# EAGLE design sfp-breakout (EAGLE 7.7.0)
VERSION: v1
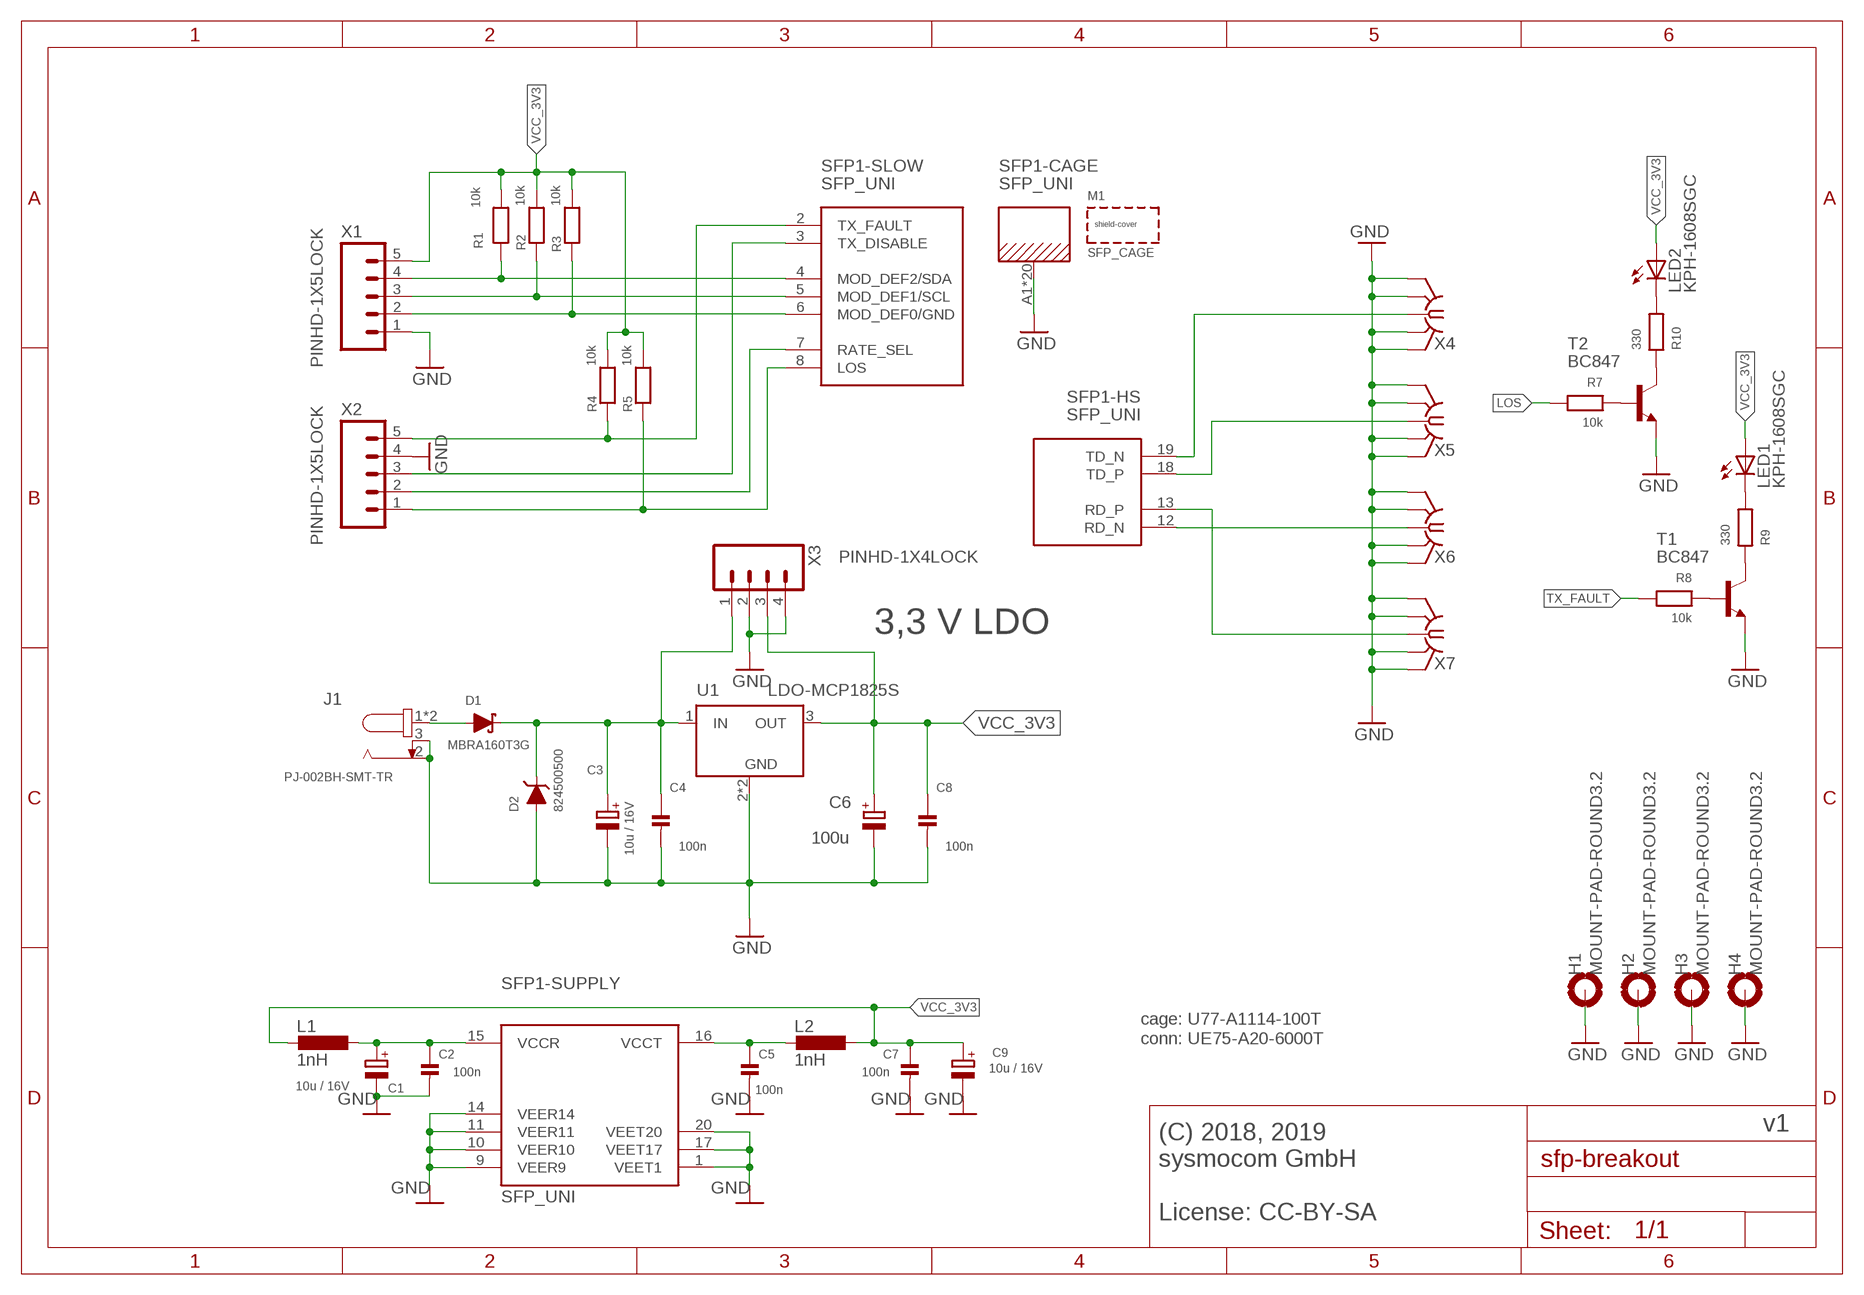
[diagram p0: schematic, sheet 1]
M1 (SHIELD-COVER): CLASS: SHIELD COVER; DESCRIPTION: CONN SFP CAGE SLD R/A; LINK: https://www.digikey.de/product-detail/de/amphenol-icc-commercial-products/U77-A1114-100T/U77-A1114-100TCT-ND; MANUFACTURER: Amphenol ICC (Commercial Products); MANUFACTURERPARTNUMBER: U77-A1114-100T; POPULATED: TRUE; ROHSCERTIFICATE: Bleifrei / RoHS-konform; SCHEM_BOM_ITEM: TRUE; SOURCE: DIGIKEY; SOURCEPARTNUMBER: U77-A1114-100TCT-ND

## Parts
C1  10u / 16V  CPOL-EU-1206  [CPOL1206]
C2  100n  CAP_CERAMIC_0603  [_0603]
C3  10u / 16V  CPOL-EU-1206  [CPOL1206]
C4  100n  CAP_CERAMIC_0603  [_0603]
C5  100n  CAP_CERAMIC_0603  [_0603]
C6  100u  CPOL-EUCT6032  [CT6032]
C7  100n  CAP_CERAMIC_0603  [_0603]
C8  100n  CAP_CERAMIC_0603  [_0603]
C9  10u / 16V  CPOL-EU-1206  [CPOL1206]
D1  MBRA160T3G  DIODE-SCHOTTKY-SMA  [SMADIODE]
D2  824500500  DIODE-TVS-SMA  [SMADIODE]
H1  MOUNT-PAD-ROUND3.2  [3,2-PAD]
H2  MOUNT-PAD-ROUND3.2  [3,2-PAD]
H3  MOUNT-PAD-ROUND3.2  [3,2-PAD]
H4  MOUNT-PAD-ROUND3.2  [3,2-PAD]
J1  PJ-002BH-SMT-TR  694108106102  [694108106102]
L1  1nH  L-EU_0603  [0603]
L2  1nH  L-EU_0603  [0603]
LED1  KPH-1608SGC  LEDCHIP-LED0603  [CHIP-LED0603]
LED2  KPH-1608SGC  LEDCHIP-LED0603  [CHIP-LED0603]
R1  10k  RESISTOR_0603  [_0603]
R2  10k  RESISTOR_0603  [_0603]
R3  10k  RESISTOR_0603  [_0603]
R4  10k  RESISTOR_0603  [_0603]
R5  10k  RESISTOR_0603  [_0603]
R7  10k  RESISTOR_0603  [_0603]
R8  10k  RESISTOR_0603  [_0603]
R9  330  RESISTOR_0603  [_0603]
R10  330  RESISTOR_0603  [_0603]
SFP1  SFP_UNI  [SFP_COMBINED]
T1  BC847  BC847C-NPN-SOT23-BEC  [SOT23-BEC]
T2  BC847  BC847C-NPN-SOT23-BEC  [SOT23-BEC]
U1  LDO-MCP1825S  [SOT223]
X1  PINHD-1X5LOCK  [1X05_LOCK]
X2  PINHD-1X5LOCK  [1X05_LOCK]
X3  PINHD-1X4LOCK  [1X04_LOCK]
X4  SMA-F-S-EDGE  [SMA-F-S-EDGE]
X5  SMA-F-S-EDGE  [SMA-F-S-EDGE]
X6  SMA-F-S-EDGE  [SMA-F-S-EDGE]
X7  SMA-F-S-EDGE  [SMA-F-S-EDGE]

## Nets
+VIN [supply]: C3.+ C4.1 D1.C D2.C U1.1(IN) X3.1
GND [GND-Polys]: C1.- C2.2 C3.- C4.2 C5.2 C6.- C7.2 C8.2 C9.- D2.A H1.B3,2(MOUNT) H2.B3,2(MOUNT) H3.B3,2(MOUNT) H4.B3,2(MOUNT) J1.2 J1.3 SFP1.1(-SUPPLY:VEET1) SFP1.9(-SUPPLY:VEER9) SFP1.10(-SUPPLY:VEER10) SFP1.11(-SUPPLY:VEER11) SFP1.14(-SUPPLY:VEER14) SFP1.17(-SUPPLY:VEET17) SFP1.20(-SUPPLY:VEET20) SFP1.A1(-CAGE:CAGE) SFP1.A2(-CAGE:CAGE) SFP1.A3(-CAGE:CAGE) SFP1.A4(-CAGE:CAGE) SFP1.A5(-CAGE:CAGE) SFP1.A6(-CAGE:CAGE) SFP1.A7(-CAGE:CAGE) SFP1.A8(-CAGE:CAGE) SFP1.A10(-CAGE:CAGE) SFP1.A11(-CAGE:CAGE) SFP1.A12(-CAGE:CAGE) SFP1.B1(-CAGE:CAGE) SFP1.B2(-CAGE:CAGE) SFP1.B3(-CAGE:CAGE) SFP1.B4(-CAGE:CAGE) SFP1.B5(-CAGE:CAGE) SFP1.B6(-CAGE:CAGE) SFP1.B7(-CAGE:CAGE) SFP1.B8(-CAGE:CAGE) SFP1.B10(-CAGE:CAGE) T1.E T2.E U1.2(GND) U1.4(GND) X1.1 X2.4 X3.2 X3.4 X4.BG1(GND) X4.BG2(GND) X4.TG1(GND) X4.TG2(GND) X5.BG1(GND) X5.BG2(GND) X5.TG1(GND) X5.TG2(GND) X6.BG1(GND) X6.BG2(GND) X6.TG1(GND) X6.TG2(GND) X7.BG1(GND) X7.BG2(GND) X7.TG1(GND) X7.TG2(GND)
LOS: R5.1 R7.2 SFP1.8(-SLOW:LOS) X2.1
MOD_DEF0/GND: R3.1 SFP1.6(-SLOW:MOD_DEF0/GND) X1.2
MOD_DEF1/SCL: R2.1 SFP1.5(-SLOW:MOD_DEF1/SCL) X1.3
MOD_DEF2/SDA: R1.1 SFP1.4(-SLOW:MOD_DEF2/SDA) X1.4
N$1 [supply]: D1.A J1.1 J1.1-1
N$3: R7.1 T2.B
N$4: LED2.C R10.2
N$5 [supply]: C5.1 L2.2 SFP1.16(-SUPPLY:VCCT)
N$6 [supply]: C1.+ C2.1 L1.1 SFP1.15(-SUPPLY:VCCR)
N$7: R10.1 T2.C
N$138: R8.1 T1.B
N$139: LED1.C R9.2
N$141: R9.1 T1.C
RATE_SEL: SFP1.7(-SLOW:RATE_SEL) X2.2
RD_N [lvds]: SFP1.12(-HS:RD_N) X6.C
RD_P [lvds]: SFP1.13(-HS:RD_P) X7.C
TD_N [lvds]: SFP1.19(-HS:TD_N) X4.C
TD_P [lvds]: SFP1.18(-HS:TD_P) X5.C
TX_DISABLE: SFP1.3(-SLOW:TX_DISABLE) X2.3
TX_FAULT: R4.1 R8.2 SFP1.2(-SLOW:TX_FAULT) X2.5
VCC_3V3 [supply]: C6.+ C7.1 C8.1 C9.+ L1.2 L2.1 LED1.A LED2.A R1.2 R2.2 R3.2 R4.2 R5.2 U1.3(OUT) X1.5 X3.3

## Notes on the sheet
- 3,3 V LDO
- cage: U77-A1114-100T
- conn: UE75-A20-6000T
- (C) 2018, 2019 
  sysmocom GmbH
  
  License: CC-BY-SA

## Library data of the parts
C1 C3 C9 = sfp-breakout:CPOL-EU; CLASS: CAPACITOR; DATASHEET: https://www.samsungsem.com/kr/support/product-search/mlcc/CL31A106KOHNNNE.jsp; DESCRIPTION: CAP CER 10UF 16V X5R 1206; LINK: https://www.digikey.com/en/products/detail/samsung-electro-mechanics/CL31A106KOHNNNE/3886795; MANUFACTURER: Samsung Electro-Mechanics; MANUFACTURERPARTNUMBER: CL31A106KOHNNNE; POPULATED: TRUE; ROHSCERTIFICATE: ROHS3 Compliant; SOURCE: DIGIKEY; SOURCEPARTNUMBER: 1276-1137-1-ND
C2 C4 C5 C7 C8 = sfp-breakout:CAP_CERAMIC: Ceramic Capacitors 0402 - 0402 Surface Mount Capacitors 16pF 50V 5% [Digikey: 445-4899-2-ND] 18pF 50V 5% [Digikey: 490-1281-2-ND] 22pF 50V 5% [Digikey: 490-1283-2-ND] 68pF 50V 5% [Digikey: 490-1289-2-ND] 0.1uF 10V 10% [Digikey: 490-1318-2-ND] 1.0uF 6.3V 10% [Digikey: 490-1320-2-ND] 0603 - 0603 Surface Mount Capacitors 16 pF 50V 5% [Digikey: 445-5051-2-ND] 22 pF 50V [Digikey: PCC220ACVTR-ND] 33 pF 50V 5% [Digikey: 490-1415-1-ND] 56pF 50V 5% [Digikey: 490-1421-1-ND] 220pF 50V 5% [Digikey: 445-1285-1-ND] 680 pF 50V 2200 pF 50V 5% C0G [Digikey: 445-1297-1-ND] 5600 pF 100V 5% X7R [Digikey: 478-3711-1-ND] 0.1 µF 25V 10% [Digikey: PCC2277TR-ND] 0.22 µF 16V 10% X7R [Digikey: 445-1318-1-ND] 1.0 µF 25V 10% [Digikey: 445-5146-2-ND] 0603 - RF Specific 3pF 250V +/-0.1pF RF [Digikey: 712-1347-1-ND] 18 pF 250V 5% [Digikey: 478-3505-1-ND or 712-1322-1-ND] 56 pF 250V 5% C0G RF [Digikey: 490-4867-1-ND] 68 pF 250V RF [Digikey: 490-4868-1-ND] 0805 - 0805 Surface Mount Capacitors 220 pF 250V 2% RF Ceramic Capacitor [Digikey: 712-1398-1-ND] 1000 pF 50V 2% NP0 Ceramic Capacitor [Digikey: 478-3760-1-ND] 0.1 µF 25V 10% Ceramic Capacitor [Digikey: PCC1828TR-ND] 1.0 µF 16V 10% Ceramic Capacitor[Digikey: 490-1691-2-ND] 10.0 µF 10V 10% Ceramic Capacitor[Digikey: 709-1228-1-ND] 10.0 uF 16V 10% Ceramic Capacitor [Digikey: 478-5165-2-ND] 47 uF 6.3V 20% Ceramic Capacitor [Digikey: 587-1779-1-ND or 399-5506-1-ND] 1206 - 1206 Surface Mount Capacitors 47uF 10V 20% Ceramic Capacitor [Digikey: 490-5528-1-ND or 399-5508-1-ND or 445-6010-1-ND] 100uF 6.3V -20%, +80% Y5V Ceramic Capacitor (Digikey: 490-4512-1-ND, Mouser: 81-GRM31CF50J107ZE1L) 1810 - 1810 Surface Mount Capacitors High volt MLC; no solder stop between for higher isolation; CLASS: CAPACITOR; DATASHEET: http://www.samsungsem.com/kr/support/product-search/mlcc/CL10B104KO8NNNC.jsp; DESCRIPTION: CAP CER 0.1UF 16V X7R 0603; LINK: https://www.digikey.com/product-detail/en/samsung-electro-mechanics/CL10B104KO8NNNC/1276-1005-1-ND/3889091; MANUFACTURER: Samsung Electro-Mechanics; MANUFACTURERPARTNUMBER: CL10B104KO8NNNC; POPULATED: TRUE; ROHSCERTIFICATE: ROHS3 Compliant; SOURCE: DIGIKEY; SOURCEPARTNUMBER: 1276-1005-1-ND
C6 = rcl:CPOL-EU: POLARIZED CAPACITOR, European symbol; CLASS: CAPACITOR; DATASHEET: https://datasheets.avx.com/TPS.pdf; DESCRIPTION: CAP TANT 100UF 10% 6.3V 2312; LINK: https://www.digikey.com/product-detail/en/avx-corporation/TPSC107K006R0150/478-1764-1-ND/564796; MANUFACTURER: AVX Corporation; MANUFACTURERPARTNUMBER: TPSC107K006R0150; POPULATED: TRUE; ROHSCERTIFICATE: ROHS3 Compliant; SOURCE: DIGIKEY; SOURCEPARTNUMBER: 478-1764-1-ND
D1 = sfp-breakout:DIODE-SCHOTTKY: Diode SMA Model Volts Amps Type Vf Vr Digikey # Notes SSA34-E3 40V 3A Schottky 480mV @ 3A 200uA @ 40V SSA34-E3/61TGITR-ND CDBA120-G 20V 1A Schottky 500mV @ 1A 500uA @ 20V 641-1014-6-ND REEL MBRA210 10V 2A Schottky 350mV @ 2A 700uA @ 10V MBRA210LT3 SOD-123 Model Volts Amps Type Vf Vr Order # Notes BAT54T1G 30V 200mA Schottky 800mV @ 200mA 2uA @ 25V BAT54T1GOSTR-ND B0530W 30V 500mA Schottky 430mV @ 500mA 130uA @ 30V B0530W-FDICT-ND REEL MBR120 1A 20V Schottky 340mV @ 1A MBR120VLSFT1GOSCT-ND SOD-323 Model Volts Amps Type Vf Vr Order # Notes PMEG2005EJ 20V 500mA Schottky 355mV @ 500mA 568-4110-1-ND ZLLS410 10V 570mA Schottky 380mV @ 570mA ZLLS410CT-ND 1N4148WS 75V 150mA Silicon/Simple 1V 1N4148WSFSCT-ND REEL SOD-523 Model Volts Amps Type Vf Vr Order # Notes BAT54XV2 30V 200mA Schottky 0.8V @ 100mA BAT54XV2CT-ND TB751S 30V 30mA Schottky RB751S-40TE61CT-ND SOT23-R/W (R = Solder Paste/Reflow Ovens, W = Hand-Soldering) Model Volts Amps Type Vf Vr Order # Notes BAT54FILM 40V 300mA Schottky 497-7162-1-ND; CLASS: DIODE; DATASHEET: https://www.diodes.com/assets/Datasheets/B220_A-B260_A.pdf; DESCRIPTION: DIODE SCHOTTKY 60V 2A SMA; LINK: https://www.digikey.com/en/products/detail/diodes-incorporated/B260A-13-F/750837; MANUFACTURER: Diodes Incorporated; MANUFACTURERPARTNUMBER: B260A-13-F; POPULATED: TRUE; ROHSCERTIFICATE: ROHS3 Compliant; SOURCE: DIGIKEY; SOURCEPARTNUMBER: B260A-FDICT-ND
D2 = sfp-breakout:DIODE-TVS; CLASS: DIODE; DATASHEET: https://www.we-online.de/katalog/datasheet/824500500.pdf; DESCRIPTION: TVS DIODE 5V 9.2V DO214AC; LINK: https://www.digikey.com/product-detail/en/w-rth-elektronik/824500500/732-9974-1-ND/5871127; MANUFACTURER: Würth Elektronik; MANUFACTURERPARTNUMBER: 824500500; POPULATED: TRUE; ROHSCERTIFICATE: ROHS3 Compliant; SOURCE: DIGIKEY; SOURCEPARTNUMBER: 732-9974-1-ND
H1-H4 = sfp-breakout:MOUNT-PAD-ROUND: MOUNTING PAD, round; CLASS: HOLE; DESCRIPTION: NO DESCRIPTION; LINK: UNKNOWN LINK; MANUFACTURER: UNKNOWN MANUFACTURER; MANUFACTURERPARTNUMBER: UNKNOWN MANUFACTURER PART NUMBER; POPULATED: FALSE; ROHSCERTIFICATE: UNKNOWN ROHS CERTIFICATE; SOURCE: UNKNOWN SOURCE; SOURCEPARTNUMBER: UNKNOWN SOURCE PART NUMBER
J1 = Wurth_Elektronik_Electromechanic_DC_Power_Jack_Connectors_rev15c:694108106102: WR-DC_DC Power Jack_Right Angled_SMT Center Pin Ø2.5_Plug ID Ø2.55_Plug OD Ø5.5_with 4 Soldering Pad & Peg ;=>Code : Con_WR-DC_SMT_694108106102_694108106102 <http://katalog.we-online.de/media/images/eican/Con_WR-DC_SMT_694108106102_pf2.jpg> Details see: http://katalog.we-online.de/em/datasheet/6941xx106102.pdf Created 2014-10-08, Karrer Zheng 2014 (C) Wurth Elektronik; CLASS: CONNECTOR; DATASHEET: https://www.cuidevices.com/product/resource/pj-002bh-smt-tr.pdf; DESCRIPTION: CONN PWR JACK 2.5X5.5MM SOLDER; LINK: https://www.digikey.com/product-detail/en/cui-devices/PJ-002BH-SMT-TR/CP-002BHPJCT-ND/669694; MANUFACTURER: CUI Devices; MANUFACTURERPARTNUMBER: PJ-002BH-SMT-TR; POPULATED: TRUE; ROHSCERTIFICATE: RoHS Compliant; SOURCE: DIGIKEY; SOURCEPARTNUMBER: CP-002BHPJCT-ND
L1 L2 = sfp-breakout:L-EU: Inductor; CLASS: INDUCTOR; DATASHEET: https://abracon.com/Magnetics/new/AIMC-0603.pdf; DESCRIPTION: FIXED IND 1NH 500MA 50 MOHM SMD; LINK: https://www.digikey.com/product-detail/en/abracon-llc/AIMC-0603-1N0S-T/535-11529-1-ND/2782759; MANUFACTURER: Abracon LLC; MANUFACTURERPARTNUMBER: AIMC-0603-1N0S-T; POPULATED: TRUE; ROHSCERTIFICATE: RoHS Compliant; SOURCE: DIGIKEY; SOURCEPARTNUMBER: 535-11529-1-ND
LED1 LED2 = led:LED: LED OSRAM: - CHIPLED LG R971, LG N971, LY N971, LG Q971, LY Q971, LO R971, LY R971 LH N974, LH R974 LS Q976, LO Q976, LY Q976 LO Q996 - Hyper CHIPLED LW Q18S LB Q993, LB Q99A, LB R99A - SideLED LS A670, LO A670, LY A670, LG A670, LP A670 LB A673, LV A673, LT A673, LW A673 LH A674 LY A675 LS A676, LA A676, LO A676, LY A676, LW A676 LS A679, LY A679, LG A679 - Hyper Micro SIDELED® LS Y876, LA Y876, LO Y876, LY Y876 LT Y87S - SmartLED LW L88C, LW L88S LB L89C, LB L89S, LG L890 LS L89K, LO L89K, LY L89K LS L896, LA L896, LO L896, LY L896 - TOPLED LS T670, LO T670, LY T670, LG T670, LP T670 LSG T670, LSP T670, LSY T670, LOP T670, LYG T670 LG T671, LOG T671, LSG T671 LB T673, LV T673, LT T673, LW T673 LH T674 LS T676, LA T676, LO T676, LY T676, LB T676, LH T676, LSB T676, LW T676 LB T67C, LV T67C, LT T67C, LS T67K, LO T67K, LY T67K, LW E67C LS E67B, LA E67B, LO E67B, LY E67B, LB E67C, LV E67C, LT E67C LW T67C LS T679, LY T679, LG T679 LS T770, LO T770, LY T770, LG T770, LP T770 LB T773, LV T773, LT T773, LW T773 LH T774 LS E675, LA E675, LY E675, LS T675 LS T776, LA T776, LO T776, LY T776, LB T776 LHGB T686 LT T68C, LB T68C - Hyper Mini TOPLED® LB M676 - Mini TOPLED Santana® LG M470 LS M47K, LO M47K, LY M47K Source: http://www.osram.convergy.de LUXEON: - LUMILED® LXK2-PW12-R00, LXK2-PW12-S00, LXK2-PW14-U00, LXK2-PW14-V00 LXK2-PM12-R00, LXK2-PM12-S00, LXK2-PM14-U00 LXK2-PE12-Q00, LXK2-PE12-R00, LXK2-PE12-S00, LXK2-PE14-T00, LXK2-PE14-U00 LXK2-PB12-K00, LXK2-PB12-L00, LXK2-PB12-M00, LXK2-PB14-N00, LXK2-PB14-P00, LXK2-PB14-Q00 LXK2-PR12-L00, LXK2-PR12-M00, LXK2-PR14-Q00, LXK2-PR14-R00 LXK2-PD12-Q00, LXK2-PD12-R00, LXK2-PD12-S00 LXK2-PH12-R00, LXK2-PH12-S00 LXK2-PL12-P00, LXK2-PL12-Q00, LXK2-PL12-R00 Source: www.luxeon.com KINGBRIGHT: KA-3528ASYC Source: www.kingbright.com; CLASS: LED; DESCRIPTION: NO DESCRIPTION; LINK: UNKNOWN LINK; MANUFACTURER: UNKNOWN MANUFACTURER; MANUFACTURERPARTNUMBER: UNKNOWN MANUFACTURER PART NUMBER; POPULATED: TRUE; ROHSCERTIFICATE: UNKNOWN ROHS CERTIFICATE; SOURCE: UNKNOWN SOURCE; SOURCEPARTNUMBER: UNKNOWN SOURCE PART NUMBER
R1-R5 = sfp-breakout:RESISTOR: Resistors 0402 - 0402 Surface Mount Package 22 Ohm 1% 1/16W [Digikey: 311-22.0LRTR-ND] 33 Ohm 5% 1/16W 1.0K 5% 1/16W 1.5K 5% 1/16W 2.0K 1% 1/16W 10.0K 1% 1/16W [Digikey: 311-10.0KLRTR-ND] 10.0K 5% 1/16W [Digikey: RMCF0402JT10K0TR-ND] 12.1K 1% 1/16W [Digikey: 311-22.0LRTR-ND] 100.0K 5% 1/16W 0603 - 0603 Surface Mount Package 1/10 Watt 0805 - 0805 Surface Mount Package 1/8 Watt 1206 - 1206 Surface Mount Package 2012 - 2010 Surface Mount Package 0.11 Ohm 1/2 Watt 1% Resistor - Digikey: RHM.11UCT-ND; CLASS: RESISTOR; DATASHEET: https://www.seielect.com/catalog/sei-rmcf_rmcp.pdf; DESCRIPTION: RES 10K OHM 1% 1/10W 0603; LINK: https://www.digikey.com/product-detail/en/stackpole-electronics-inc/RMCF0603FT10K0/RMCF0603FT10K0CT-ND/1943057; MANUFACTURER: Stackpole Electronics Inc; MANUFACTURERPARTNUMBER: RMCF0603FT10K0; POPULATED: TRUE; ROHSCERTIFICATE: ROHS3 Compliant; SOURCE: DIGIKEY; SOURCEPARTNUMBER: RMCF0603FT10K0CT-ND
R7 R8 = rc-sysmocom:RESISTOR: Resistors 0402 - 0402 Surface Mount Package 22 Ohm 1% 1/16W [Digikey: 311-22.0LRTR-ND] 33 Ohm 5% 1/16W 1.0K 5% 1/16W 1.5K 5% 1/16W 2.0K 1% 1/16W 10.0K 1% 1/16W [Digikey: 311-10.0KLRTR-ND] 10.0K 5% 1/16W [Digikey: RMCF0402JT10K0TR-ND] 12.1K 1% 1/16W [Digikey: 311-22.0LRTR-ND] 100.0K 5% 1/16W 0603 - 0603 Surface Mount Package 1/10 Watt 0805 - 0805 Surface Mount Package 1/8 Watt 1206 - 1206 Surface Mount Package 2012 - 2010 Surface Mount Package 0.11 Ohm 1/2 Watt 1% Resistor - Digikey: RHM.11UCT-ND; CLASS: RESISTOR; DATASHEET: https://www.seielect.com/catalog/sei-rmcf_rmcp.pdf; DESCRIPTION: RES 10K OHM 1% 1/10W 0603; LINK: https://www.digikey.com/product-detail/en/stackpole-electronics-inc/RMCF0603FT10K0/RMCF0603FT10K0CT-ND/1943057; MANUFACTURER: Stackpole Electronics Inc; MANUFACTURERPARTNUMBER: RMCF0603FT10K0; POPULATED: TRUE; ROHSCERTIFICATE: ROHS3 Compliant; SOURCE: DIGIKEY; SOURCEPARTNUMBER: RMCF0603FT10K0CT-ND
R9 R10 = rc-sysmocom:RESISTOR: Resistors 0402 - 0402 Surface Mount Package 22 Ohm 1% 1/16W [Digikey: 311-22.0LRTR-ND] 33 Ohm 5% 1/16W 1.0K 5% 1/16W 1.5K 5% 1/16W 2.0K 1% 1/16W 10.0K 1% 1/16W [Digikey: 311-10.0KLRTR-ND] 10.0K 5% 1/16W [Digikey: RMCF0402JT10K0TR-ND] 12.1K 1% 1/16W [Digikey: 311-22.0LRTR-ND] 100.0K 5% 1/16W 0603 - 0603 Surface Mount Package 1/10 Watt 0805 - 0805 Surface Mount Package 1/8 Watt 1206 - 1206 Surface Mount Package 2012 - 2010 Surface Mount Package 0.11 Ohm 1/2 Watt 1% Resistor - Digikey: RHM.11UCT-ND; CLASS: RESISTOR; DATASHEET: https://www.yageo.com/upload/media/product/productsearch/datasheet/rchip/PYu-RC_Group_51_RoHS_L_11.pdf; DESCRIPTION: RES SMD 330 OHM 1% 1/10W 0603; LINK: https://www.digikey.com/product-detail/en/yageo/RC0603FR-07330RL/311-330HRCT-ND/730109; MANUFACTURER: Yageo; MANUFACTURERPARTNUMBER: RC0603FR-07330RL; POPULATED: TRUE; ROHSCERTIFICATE: ROHS3 Compliant; SOURCE: DIGIKEY; SOURCEPARTNUMBER: 311-330HRCT-ND
SFP1 = sfp-breakout:SFP_UNI; CLASS: CONNECTOR; DATASHEET: https://media.digikey.com/pdf/Data%20Sheets/Amphenol%20PDFs/Ux75-A20-x00xx.pdf; DESCRIPTION: CONN SFP RCPT 20POS SLD R/A SMD; LINK: https://www.digikey.com/product-detail/en/amphenol-icc-commercial-products/UE75-A20-6000T/UE75-A20-6000TCT-ND/1242798; MANUFACTURER: Amphenol ICC (Commercial Products); MANUFACTURERPARTNUMBER: UE75-A20-6000T; POPULATED: TRUE; ROHSCERTIFICATE: RoHS Compliant; SOURCE: DIGIKEY; SOURCEPARTNUMBER: UE75-A20-6000TCT-ND
T1 T2 = transistor:*-NPN-: NPN Transistror BF959 corrected 2008.03.06; CLASS: TRANSISTOR; DATASHEET: https://assets.nexperia.com/documents/data-sheet/BC847_SER.pdf; DESCRIPTION: TRANS NPN 45V 0.1A SOT23; LINK: https://www.digikey.com/product-detail/en/nexperia-usa-inc/BC847C,215/1727-2924-1-ND/763463; MANUFACTURER: Nexperia USA Inc.; MANUFACTURERPARTNUMBER: BC847C,215; POPULATED: TRUE; ROHSCERTIFICATE: ROHS3 Compliant; SOURCE: DIGIKEY; SOURCEPARTNUMBER: 1727-2924-1-ND
U1 = sfp-breakout:LDO; CLASS: IC; DATASHEET: https://ww1.microchip.com/downloads/en/DeviceDoc/22056b.pdf; DESCRIPTION: IC REG LIN 3.3V 500MA SOT223-3; LINK: https://www.digikey.com/en/products/detail/microchip-technology/MCP1825ST-3302E-DB/1635518; MANUFACTURER: Microchip Technology; MANUFACTURERPARTNUMBER: MCP1825ST-3302E/DB; POPULATED: TRUE; ROHSCERTIFICATE: ROHS3 Compliant; SOURCE: DIGIKEY; SOURCEPARTNUMBER: MCP1825ST-3302E/DBCT-ND
X1 X2 = sfp-breakout:PINHD-1X5: Header 5 Standard 5-pin 0.1" header; CLASS: CONNECTOR; DESCRIPTION: NO DESCRIPTION; LINK: UNKNOWN LINK; MANUFACTURER: UNKNOWN MANUFACTURER; MANUFACTURERPARTNUMBER: UNKNOWN MANUFACTURER PART NUMBER; POPULATED: TRUE; ROHSCERTIFICATE: UNKNOWN ROHS CERTIFICATE; SOURCE: UNKNOWN SOURCE; SOURCEPARTNUMBER: UNKNOWN SOURCE PART NUMBER
X3 = sfp-breakout:PINHD-1X4: Header 4 Standard 4-pin 0.1" header; CLASS: CONNECTOR; DESCRIPTION: NO DESCRIPTION; LINK: UNKNOWN LINK; MANUFACTURER: UNKNOWN MANUFACTURER; MANUFACTURERPARTNUMBER: UNKNOWN MANUFACTURER PART NUMBER; POPULATED: TRUE; ROHSCERTIFICATE: UNKNOWN ROHS CERTIFICATE; SOURCE: UNKNOWN SOURCE; SOURCEPARTNUMBER: UNKNOWN SOURCE PART NUMBER
X4-X7 = sfp-breakout:SMA-F; CLASS: CONNECTOR; DESCRIPTION: NO DESCRIPTION; LINK: UNKNOWN LINK; MANUFACTURER: UNKNOWN MANUFACTURER; MANUFACTURERPARTNUMBER: UNKNOWN MANUFACTURER PART NUMBER; POPULATED: TRUE; ROHSCERTIFICATE: UNKNOWN ROHS CERTIFICATE; SOURCE: UNKNOWN SOURCE; SOURCEPARTNUMBER: UNKNOWN SOURCE PART NUMBER

## Net classes
1 lvds: width 0.33 mm, clearance 0.25 mm
2 GND-Polys: width 1 mm, clearance 0.6 mm to class 1
3 supply: width 0.6 mm, clearance 0.038 mm to class 1, clearance 0.5 mm to class 2

## Board
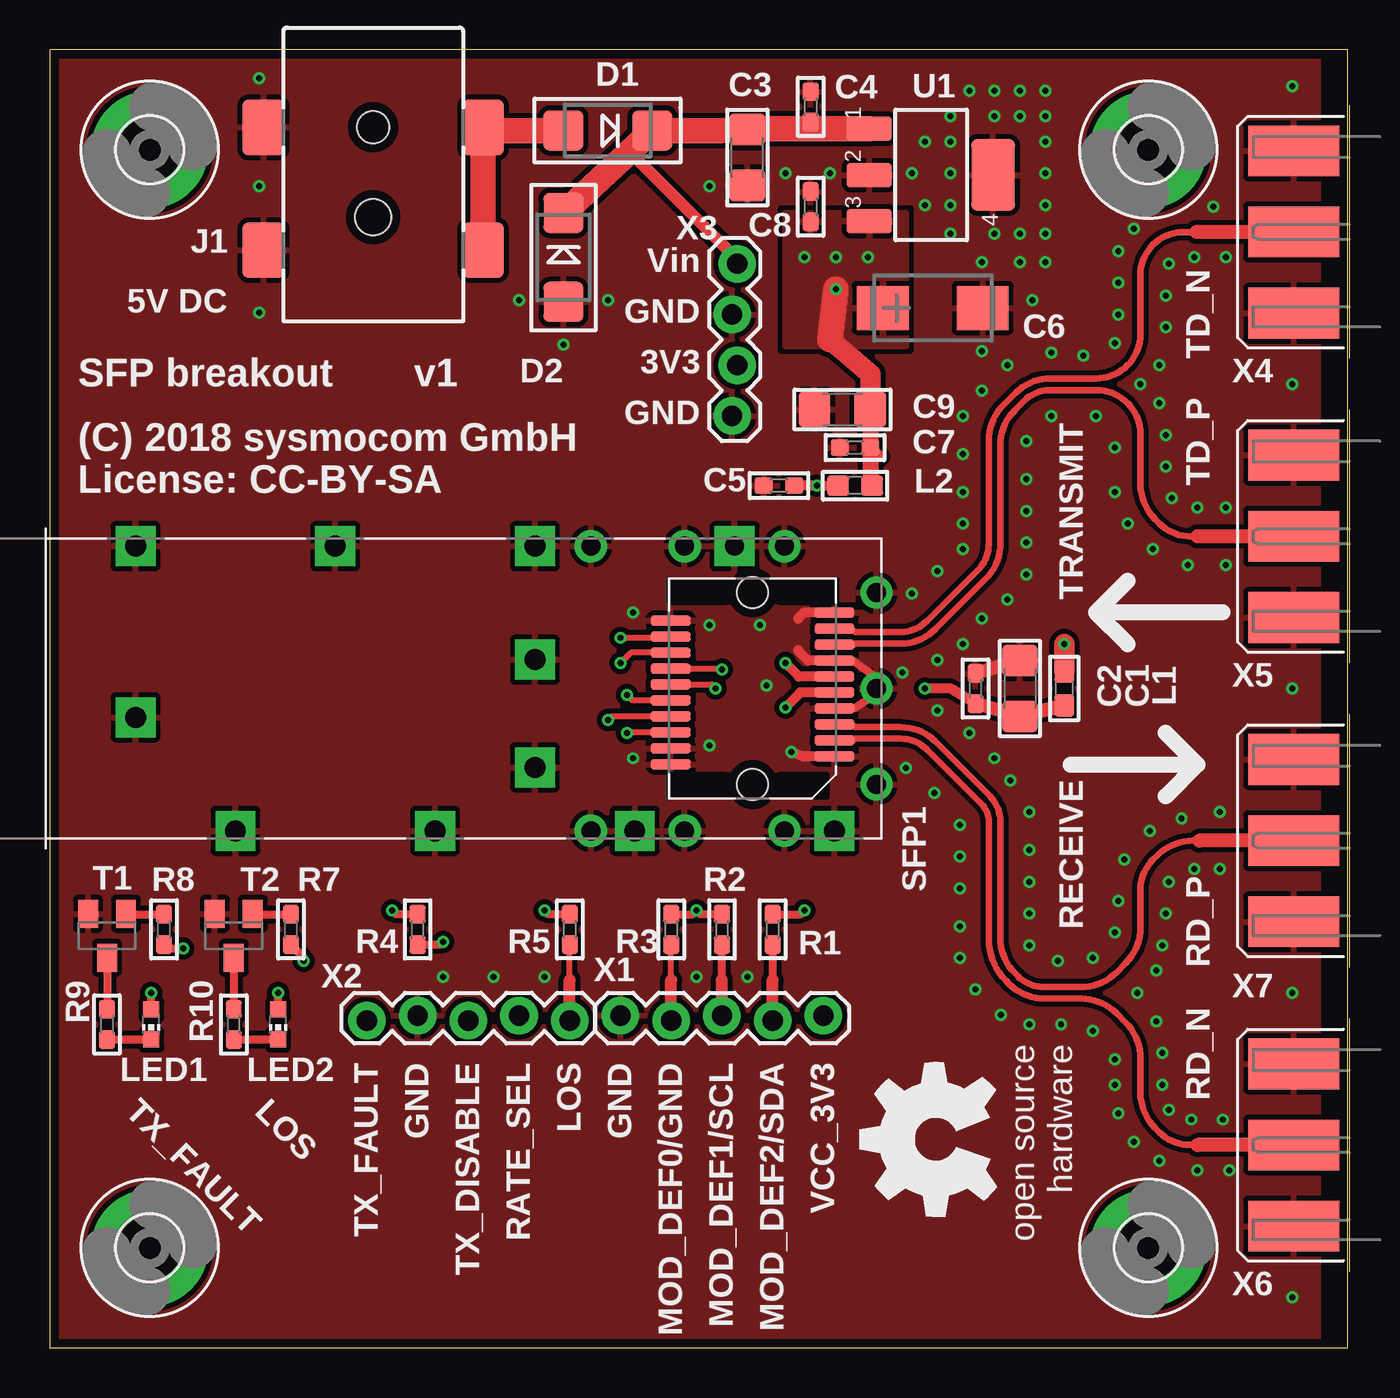
[diagram p1: board, top side]
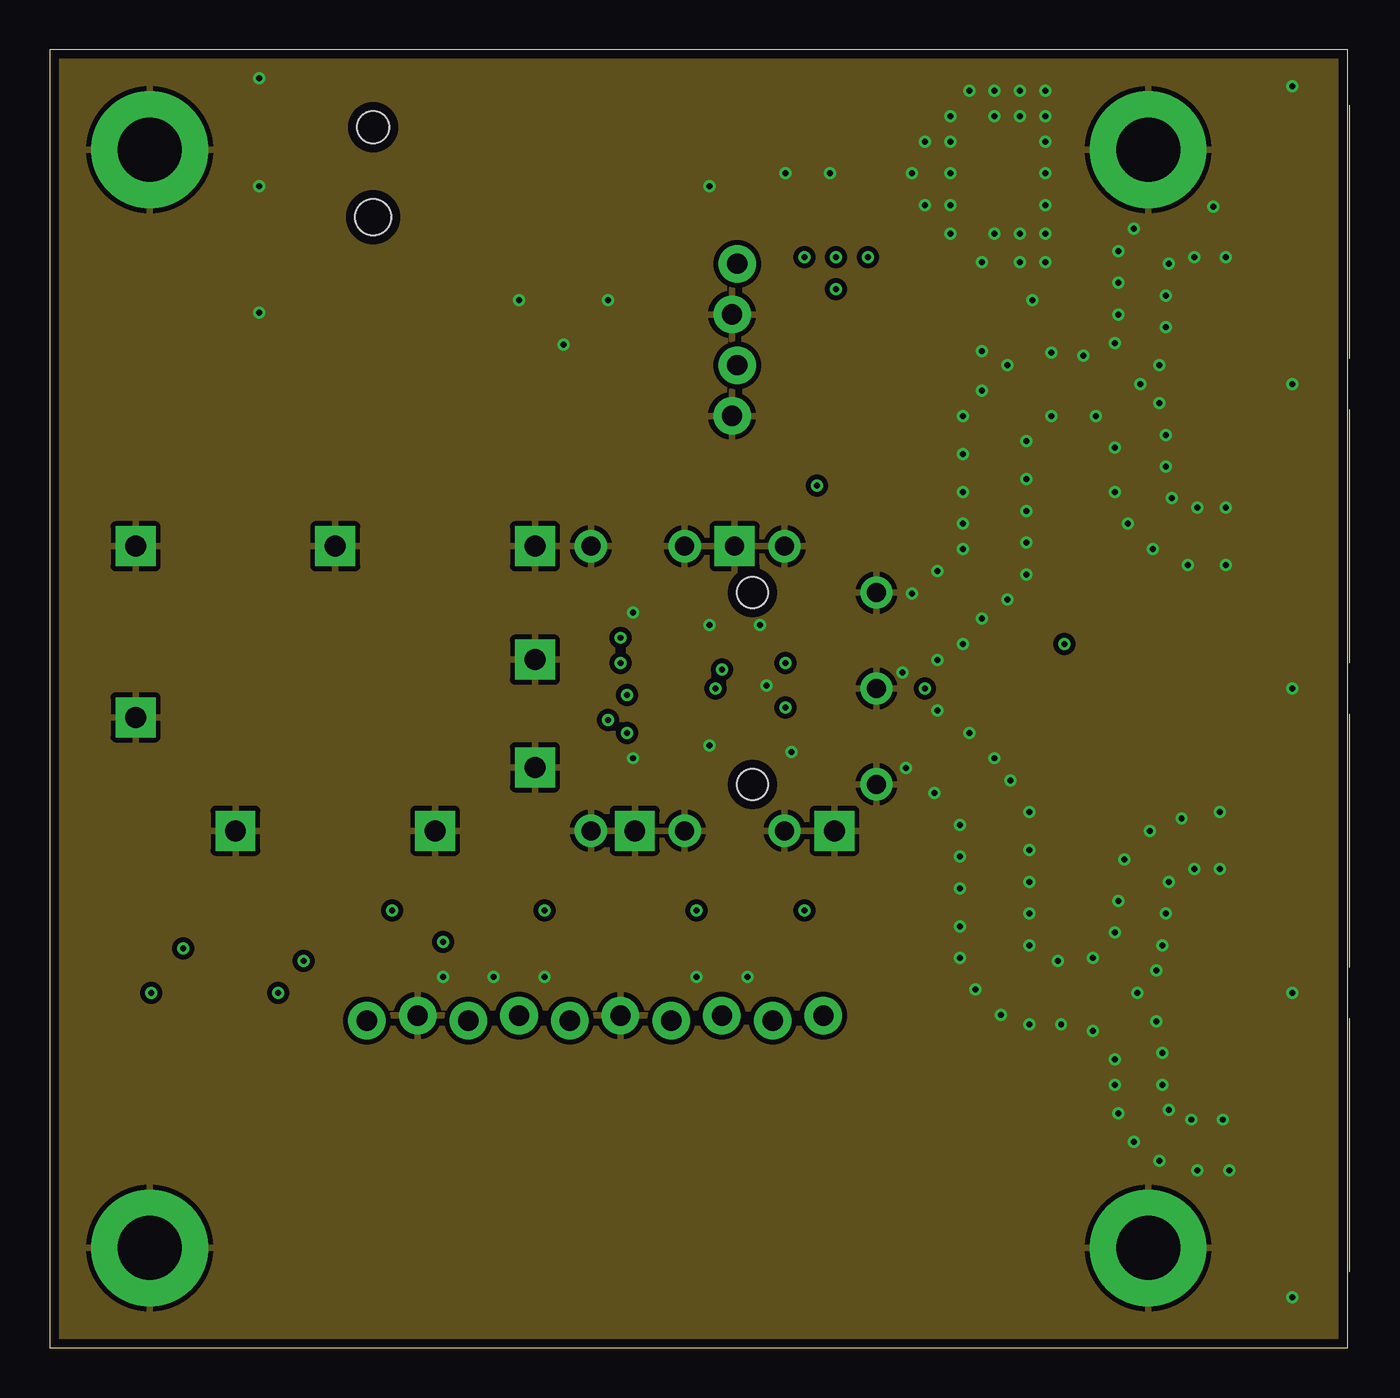
[diagram p2: board, inner layer Route2]
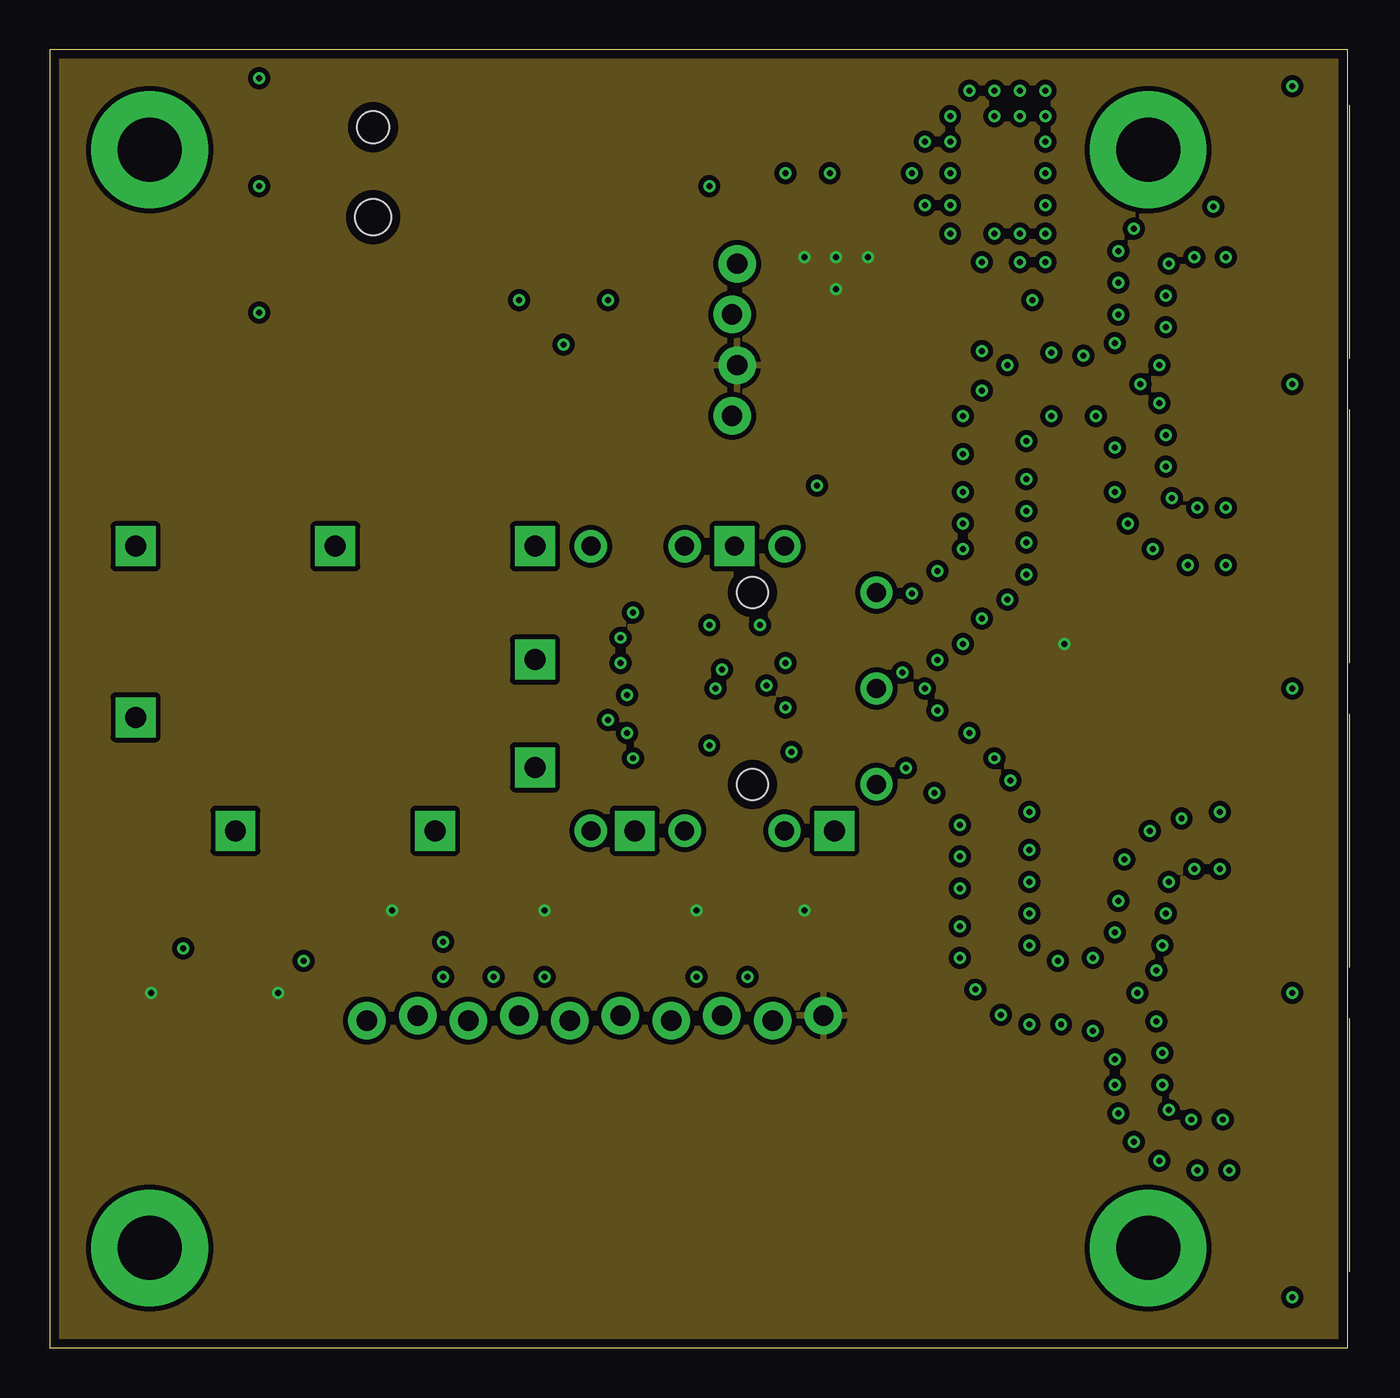
[diagram p3: board, inner layer Route15]
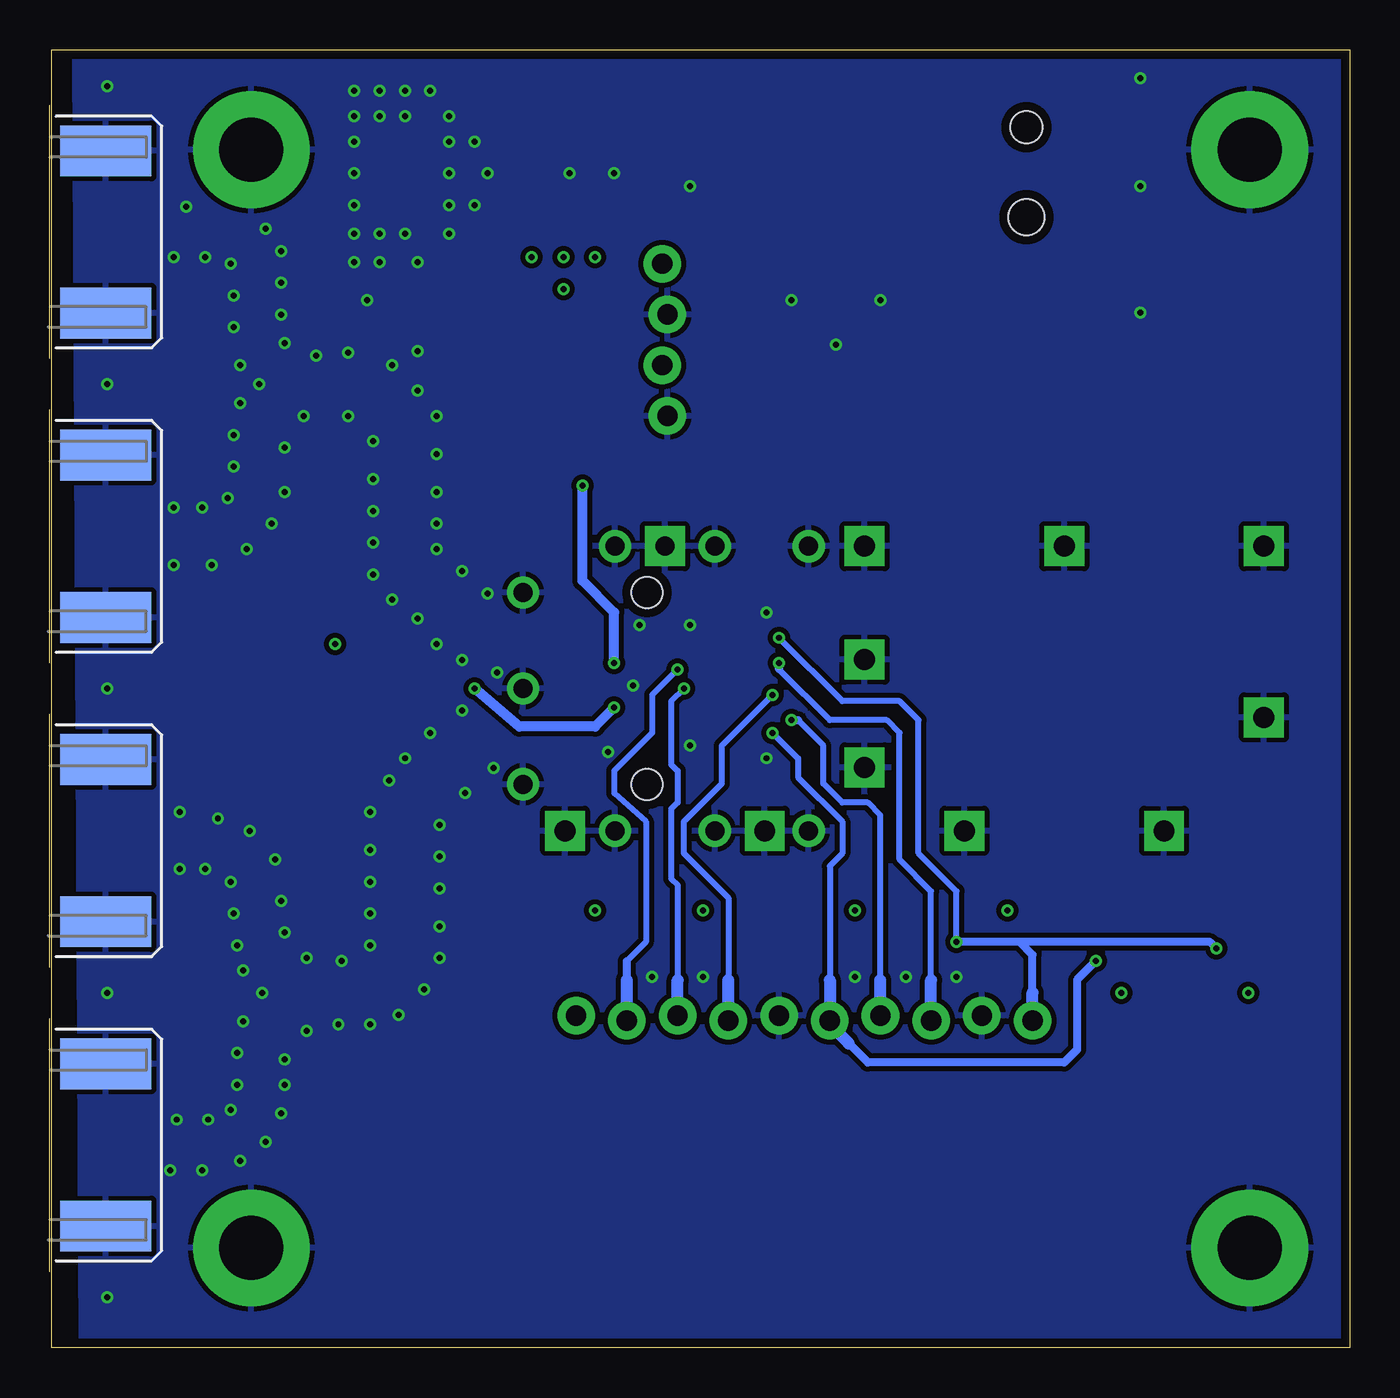
[diagram p4: board, bottom side, seen from below]

Size 65 x 65 mm. Coordinates in mm from the lower left corner, seen from the top.
Outline: 0,0 65,0 65,65 0,65 0,0
Copper layers (1+2*15+16): Top 0.035mm / dielectric 0.36mm / Route2 0.035mm / dielectric 0.71mm / Route15 0.035mm / dielectric 0.36mm / Bottom 0.035mm
Design rules "sysmocom-basista-4layer-prototype *": minimum track width 0.15mm, minimum drill 0.3mm, track to track 0.25mm, track to pad 0.25mm, pad to pad 0.25mm, via to via 0.25mm, smd to smd 0mil, copper to edge 0.45mm, drill to drill 0.25mm, minimum pad ring 0.15mm, minimum via ring 0.15mm, stop-mask expansion 0mil, vias tented up to drill 0mil, thermal gap 10mil

### Footprints (pad centres in the part's own frame; a part is rotated, then mirrored left to right if it is on the bottom)
CPOL1206 = smd 1.6 x 1.8: + 1.4,0; - -1.4,0
_0603 = smd 0.9 x 0.8: 1 -0.762,0; 2 0.762,0
CT6032 = smd 2.6 x 2.2: + -2.5,0; - 2.5,0
SMADIODE = smd 2 x 2: A 2.223,0; C -2.223,0
3,2-PAD = drill 3.2 pad 5.842: B3,2 0,0
694108106102 = smd 2.8 x 2.1: 1 11.15,5.5; 1-1 5,5.5; 2 5,-5.5; 3 11.15,-5.5 | hole 1.6: 5,0 | hole 1.8: 9.5,0
0603 = smd 1.1 x 1: 1 -0.85,0; 2 0.85,0
CHIP-LED0603 = smd 0.8 x 0.8: A 0,-0.75; C 0,0.75
SFP_COMBINED = smd 2 x 0.5: 1 -3.2,3.4; 2 -3.2,2.6; 3 -3.2,1.8; 4 -3.2,1; 5 -3.2,0.2; 6 -3.2,-0.6; 7 -3.2,-1.4; 8 -3.2,-2.2; 9 -3.2,-3; 10 -3.2,-3.8; 11 5,-3.4; 12 5,-2.6; 13 5,-1.8; 14 5,-1; 15 5,-0.2; 16 5,0.6; 17 5,1.4; 18 5,2.2; 19 5,3; 20 5,3.8 | drill 1.05 pad 2 square: A1 -30,7.125; A2 -20,7.125; A3 -10,7.125; A5 -25,-7.125; A6 -15,-7.125; A7 -5,-7.125; A8 5,-7.125; A10 -30,-1.45; A11 -10,1.45; A12 -10,-3.95 | drill 0.95 pad 2 square: A4 0,7.125 | drill 0.95: B1 -7.2,7.125; B2 -2.5,7.125; B3 2.5,7.125; B7 2.5,-7.125; B8 -2.5,-7.125; B10 -7.2,-7.125 | drill 0.95 pad 1.27: B4 7.1,4.8; B5 7.1,0; B6 7.1,-4.8 | hole 1.55: 0.9,4.8; 0.9,-4.8
SOT23-BEC = smd 1 x 1.4: B -0.95,-1.1; C 0,1.1; E 0.95,-1.1
SOT223 = smd 1.219 x 2.235: 1 -2.311,-3.099; 2 0,-3.099; 3 2.311,-3.099 | smd 3.6 x 2.2: 4 0,3.099
1X05_LOCK = drill 1.016 pad 1.88: 1 0,0.127; 2 2.54,-0.127; 3 5.08,0.127; 4 7.62,-0.127; 5 10.16,0.127
1X04_LOCK = drill 1.016 pad 1.88: 1 0,0.127; 2 2.54,-0.127; 3 5.08,0.127; 4 7.62,-0.127
SMA-F-S-EDGE = smd 4.572 x 2.54 bottom: BG1 2.794,-4.064; BG2 2.794,4.064 | smd 4.572 x 2.54: C 2.794,0; TG1 2.794,-4.064; TG2 2.794,4.064

### Placement (x,y rotation side)
C1  48.58,33.02 270 top
C2  46.35,33.02 90 top
C3  34.92,59.61 90 top
C4  38.1,62.15 90 top
C5  36.51,43.18 180 top
C6  44.21,52.07 0 top
C7  40.32,45.09 180 top
C8  38.1,57.15 90 top
C9  39.69,46.99 0 top
D1  27.94,60.96 180 top
D2  25.72,54.61 270 top
H1  5,5 0 top
H2  55,60 0 top
H3  55,5 0 top
H4  5,60 0 top
J1  16.19,66.12 270 top
L1  50.8,33.02 90 top
L2  40.32,43.18 180 top
LED1  5.08,16.19 180 top
LED2  11.43,16.19 180 top
R1  36.2,20.95 90 top
R2  33.66,20.95 90 top
R3  31.11,20.95 90 top
R4  18.41,20.95 90 top
R5  26.04,20.95 90 top
R7  12.06,20.95 270 top
R8  5.71,20.95 270 top
R9  2.86,16.19 270 top
R10  9.21,16.19 270 top
SFP1  34.29,33.02 0 top
T1  2.86,20.64 180 top
T2  9.21,20.64 180 top
U1  44.13,58.74 270 top
U$1  [OSHW_8MM]  44.38,10.42 90 top
X1  28.57,16.51 0 top
X2  26.04,16.51 180 top
X3  34.29,54.29 270 top
X4  65.09,55.88 180 top
X5  65.09,40.64 180 top
X6  65.09,10.16 180 top
X7  65.09,25.4 180 top

### Tracks (layer width: path | path; a pad name or v marks a point on that pad's centre or on a via)
+VIN
  Top 0.33: C4.1 37.47,61.05
  Top 0.6: X3.1 34.3,54.61 29.02,59.9
  Top 1.27: 34.99,61.07 34.96,61.05 | U1.1 37.47,61.05 34.96,61.05 | 34.96,61.05 C3.+ 33.6,60.96 D1.C 29.02,59.9 D2.C
GND  (via drill 0.3)
  Top 0.406: SFP1.14 40.27,32.02 41.27,32.7 41.27,32.91 SFP1.B5 | SFP1.B5 41.39,32.5 | SFP1.17 40.19,34.42 41.27,33.66 41.27,33.13 SFP1.B5
  Top 0.5: SFP1.20 37.77,36.82 37.47,36.51 | SFP1.11 37.69,29.62 v37.15,29.84 | SFP1.17 37.97,34.42 37.47,34.92
  Top 0.7: C1.- C2.2
  other vias: 27.94,52.47 46.67,54.37 23.5,52.47 49.85,60.41 47.31,61.67 49.85,58.82 58.9,39.21 33.02,36.2 29.21,36.83 29.21,29.53 35.56,36.2 33.02,30.16 62.23,48.26 62.23,17.78 56.99,39.21 55.24,40.01 53.98,41.27 53.34,42.86 53.34,45.09 52.39,46.67 50.16,46.67 48.9,45.4 48.9,43.5 48.9,41.91 48.9,40.32 48.9,38.73 47.94,37.47 46.67,36.51 45.72,35.24 42.7,33.81 46.04,30.8 47.31,29.53 48.1,28.42 49.05,26.83 49.05,24.92 49.05,23.34 49.05,21.75 49.05,20.16 50.48,19.37 52.23,19.53 53.34,20.8 53.5,22.38 53.82,24.45 55.09,25.88 56.67,26.51 58.58,26.83 43.18,37.78 45.72,40.01 45.72,41.27 45.72,42.86 45.72,44.77 45.72,46.67 46.67,47.94 47.94,49.21 50.16,49.85 51.75,49.69 53.34,50.32 53.5,51.75 53.5,53.34 53.5,54.93 54.29,56.04 58.26,57.15 58.9,54.61 57.31,54.61 56.04,54.29 55.88,52.7 55.88,51.12 55.56,49.21 54.61,48.26 55.56,47.31 55.88,45.72 55.88,44.13 56.2,42.55 57.47,42.07 58.9,42.07 58.58,23.97 57.31,23.97 56.04,23.34 55.88,21.75 55.72,20.16 55.4,18.89 54.45,17.78 55.4,16.35 55.72,14.76 55.72,13.18 56.04,11.91 57.15,11.43 58.74,11.43 59.05,8.89 57.47,8.89 55.56,9.37 54.29,10.32 53.5,11.75 53.34,13.18 53.34,14.45 52.23,15.88 50.64,16.19 49.05,16.19 47.62,16.67 46.35,17.94 45.56,19.53 45.56,21.11 45.56,23.02 45.56,24.61 45.56,26.19 42.86,29.05 62.23,63.18 62.23,33.02 62.23,2.54 32.38,18.57 34.92,18.57 24.77,18.57 22.23,18.57 19.68,18.57 49.85,61.67 43.18,58.82 36.83,58.82 39.05,58.82 33.02,58.18 47.31,55.8 49.85,55.8 49.85,57.23 45.09,60.41 45.09,57.23 44.45,38.89 44.45,34.45 44.45,31.91 44.29,27.78 10.48,58.18 10.48,63.58 10.48,51.83 46.67,49.93 49.21,52.47 25.72,50.24 35.88,33.18 45.09,61.67 45.09,55.8 43.81,60.41 43.81,57.23 45.09,58.82 49.85,62.95 47.31,62.95 49.85,54.37 48.58,62.95 48.58,61.67 48.58,55.8 48.58,54.37 46.04,62.95
  pour Top (rank 2): 0.32,64.84 63.5,64.84 63.5,0.32 0.32,0.32
  pour Bottom (rank 2): 0,0 63.5,0 63.82,64.85 0.32,64.85
  pour Route2: 0.32,65.09 64.77,65.09 64.77,0.77 arc45 65.09,0 0,0 0,65.09
LOS  (via drill 0.3)
  Top 0.305: 26.04,18.41 R5.1 | SFP1.8 28.91,30.82 v28.89,30.8
  Top 0.406: R7.2 12.7,19.56 v12.7,19.37
  Top 0.61: X2.1 26.04,18.41
  Bottom 0.305: v28.89,30.8 27.62,29.53 27.62,28.57 25.4,26.35 25.4,24.77 26.04,24.13 26.04,18.41
  Bottom 0.406: v12.7,19.37 13.65,18.41 13.65,14.92 14.29,14.29 24.13,14.29 25.08,15.24 | 26.04,16.19 X2.1
  Bottom 0.61: 26.04,16.19 25.08,15.24 | 26.04,18.41 X2.1
MOD_DEF0/GND  (via drill 0.3)
  Top 0.305: SFP1.6 29.18,32.42 v28.89,32.7 | 31.11,18.41 R3.1
  Top 0.61: X1.2 31.11,18.41
  Bottom 0.305: v28.89,32.7 31.43,30.16 31.43,28.26 33.34,26.35 33.34,24.77 31.11,22.54 31.11,18.41
  Bottom 0.61: X1.2 31.11,18.41
MOD_DEF1/SCL  (via drill 0.3)
  Top 0.305: SFP1.5 33.14,33.22 v33.34,33.02
  Top 0.406: 33.66,18.41 R2.1
  Top 0.61: X1.3 33.66,18.41
  Bottom 0.305: v33.34,33.02 33.97,32.38 33.97,29.21 33.66,28.89 33.66,27.3 33.97,26.99 33.97,23.5 33.66,23.18 33.66,18.41
  Bottom 0.61: X1.3 33.66,18.41
MOD_DEF2/SDA  (via drill 0.3)
  Top 0.305: SFP1.4 33.61,34.02
  Top 0.406: 33.61,34.02 v33.66,33.97 | R1.1 36.2,18.41
  Top 0.61: X1.4 36.2,18.41
  Bottom 0.305: 36.2,19.37 35.24,20.32 35.24,26.35 36.83,27.78 36.83,28.89 34.92,30.8 34.92,32.7 v33.66,33.97
  Bottom 0.406: 36.2,18.41 36.2,19.37
  Bottom 0.61: X1.4 36.2,18.41
N$1
  Top 1.27: J1.1 J1.1-1 | 21.85,61.28 J1.1-1 | D1.A 21.85,60.96 J1.1-1
N$3
  Top 0.305: T2.B 10.18,21.72
  Top 0.406: 10.18,21.72 R7.1
N$4
  Top 0.406: R10.2 9.22,15.44 LED2.C
N$5  (via drill 0.3)
  Top 0.5: SFP1.16 37.5,33.62 v36.83,34.29 | L2.2 v38.42,43.18 C5.1
  Bottom 0.5: v36.83,34.29 36.83,36.83 38.42,38.42 v38.42,43.18
N$6  (via drill 0.3)
  Top 0.5: SFP1.15 37.58,32.82 v36.83,32.07 | C2.1 45.09,33.02 v43.81,33.02
  Top 0.7: C2.1 C1.+ L1.1
  Bottom 0.5: v36.83,32.07 37.78,31.11 41.59,31.11 v43.81,33.02
N$7
  Top 0.406: T2.C R10.1
N$138
  Top 0.305: T1.B 3.83,21.72
  Top 0.406: 3.83,21.72 R8.1
N$139
  Top 0.406: R9.2 2.87,15.44 LED1.C
N$141
  Top 0.406: T1.C R9.1
RATE_SEL  (via drill 0.3)
  Top 0.305: SFP1.7 28.13,31.62 v27.94,31.43
  Bottom 0.305: 27.62,31.43 26.35,30.16 26.35,28.26 25.4,27.3 24.13,27.3 23.5,26.67 23.5,18.41
  Bottom 0.406: v27.94,31.43 27.62,31.43
  Bottom 0.61: X2.2 23.5,18.41
RD_N
  Top 0.26: SFP1.12 39.92,30.42
  Top 0.33: 39.92,30.42 40.11,30.42 arc45 40.32,30.51 42.6,30.51 arc-45 43.93,29.96 46.65,27.23 arc-45 47.02,26.35 47.02,20.46 arc45 47.87,18.39 48.05,18.21 arc45 49.79,17.49 51.62,17.49 arc-45 53.42,16.75 53.87,16.3 arc-45 54.61,14.51 54.61,12.8 arc45 55.35,11 55.56,10.79 arc45 57.1,10.16 57.47,10.16
  Top 0.7: X6.C 57.47,10.16
RD_P
  Top 0.26: SFP1.13 39.81,31.22
  Top 0.33: 39.81,31.22 40,31.22 arc-45 40.32,31.09 42.6,31.09 arc-45 44.34,30.37 47.06,27.64 arc-45 47.6,26.35 47.6,20.54 arc45 48.34,18.74 48.47,18.62 arc45 49.79,18.07 51.62,18.07 arc45 53.42,18.81 53.87,19.26 arc45 54.61,21.05 54.61,22.91 arc-45 55.24,24.45 55.45,24.66 arc-45 57.25,25.4 57.57,25.4
  Top 0.7: X7.C 57.57,25.4
TD_N
  Top 0.26: SFP1.19 39.72,36.02
  Top 0.33: 39.72,36.02 39.91,36.02 arc-45 40.32,35.85 42.6,35.85 arc45 43.93,36.4 46.47,38.94 arc45 47.02,40.27 47.02,45.42 arc-45 47.76,47.22 48.37,47.83 arc-45 50.11,48.55 52.39,48.55 arc45 53.97,49.2 53.98,49.21 arc45 54.61,50.75 54.61,53.71 arc-45 55.24,55.24 arc-45 56.78,55.88 57.41,55.88
  Top 0.7: X4.C 57.41,55.88
TD_P
  Top 0.26: SFP1.18 40.01,35.22
  Top 0.33: 40.01,35.22 40.2,35.22 arc45 40.32,35.27 42.6,35.27 arc45 44.34,35.99 46.88,38.53 arc45 47.6,40.27 47.6,45.18 arc-45 48.34,46.98 48.78,47.42 arc-45 50.11,47.97 52.39,47.97 arc-45 53.97,47.32 53.98,47.31 arc-45 54.61,45.77 54.61,43.28 arc45 55.35,41.48 55.56,41.27 arc45 57.1,40.64 57.47,40.64
  Top 0.7: X5.C 57.47,40.64
TX_DISABLE  (via drill 0.3)
  Top 0.305: SFP1.3 29.11,34.82 v28.57,34.29
  Bottom 0.305: 28.57,33.97 26.04,31.43 23.18,31.43 22.54,30.8 22.54,24.45 20.95,22.86 20.95,18.41
  Bottom 0.406: 28.57,33.97 v28.57,34.29
  Bottom 0.61: X2.3 20.95,18.41
TX_FAULT  (via drill 0.3)
  Top 0.15: 31.03,35.56 SFP1.2
  Top 0.305: 31.03,35.56 v28.57,35.56
  Top 0.406: R8.2 5.91,20 v6.67,20 | R4.1 19.56,20.19 v19.68,20.32
  Bottom 0.305: v19.68,20.32 19.68,22.86 21.59,24.77 21.59,31.43 22.54,32.38 25.4,32.38 v28.57,35.56
  Bottom 0.406: v6.67,20 6.99,20.32 16.51,20.32 | 16.51,20.32 v19.68,20.32 | 15.88,17.78 15.88,19.68 16.51,20.32
  Bottom 0.61: X2.5 15.88,17.78
VCC_3V3  (via drill 0.3)
  Top 0.406: R1.2 37.59,21.72 v37.78,21.91 | R4.2 17.34,21.72 v17.14,21.91 | R5.2 24.96,21.72 v24.77,21.91 | R3.2 32.19,21.72 v32.38,21.91 32.58,21.72 R2.2 | LED1.A v5.08,17.78 | LED2.A v11.43,17.78
  Top 0.6: 41.53,44.64 C7.1
  Top 0.813: C9.+ C7.1 41.08,43.22 L2.1
  Top 1.016: v50.8,35.24 L1.2 | C9.+ 41.09,48.77 39.05,50.48
  Top 1.27: 39.05,50.48 v39.37,53.02
  other vias: 40.96,54.61 37.78,54.61 39.37,54.61
  pour Route15: 0,65.09 65.09,65.09 65.09,0 0,0 -0.32,0 -0.32,65.09
  pour Top: 36.83,56.83 36.83,50.16 42.86,50.16 42.86,56.83

### Text on the board
tNames: Vin | 5V DC | GND | 3V3 | TD_N | SFP breakout | GND | (C) 2018 sysmocom GmbH / License: CC-BY-SA | TD_P | TRANSMIT | RECEIVE | RD_P | TX_FAULT | GND | TX_DISABLE | RATE_SEL | LOS | GND | MOD_DEF0/GND | MOD_DEF1/SCL | MOD_DEF2/SDA | VCC_3V3 | TX_FAULT | LOS | RD_N